# Altium schematic sheet revision_history.SchDoc
size A4; Date: 10/27/2015; Engineer: JBayalas; DocumentNumber: 2; Revision: V4.3.0; SheetNumber: 2; SheetTotal: 12
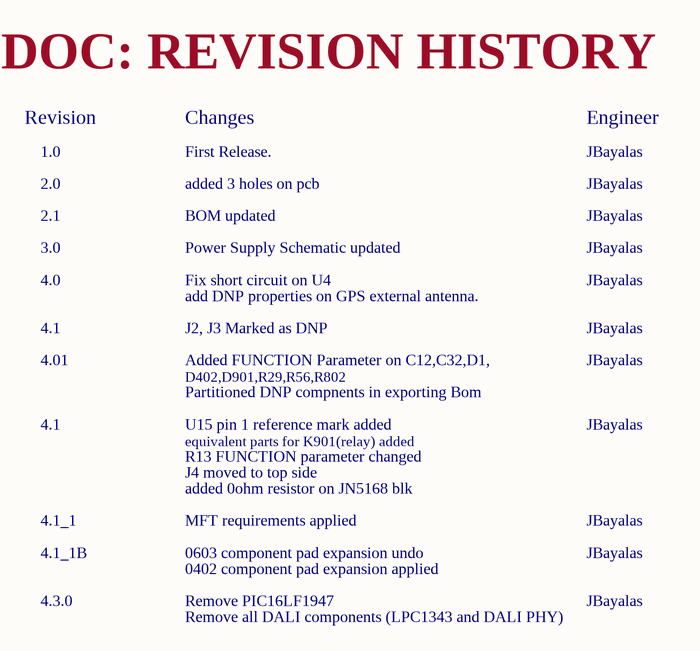
[diagram p0: revision_history.SchDoc]

## Notes on the sheet
- DOC: REVISION HISTORY
- Revision
- 1.0
- Changes
- First Release.
- Engineer
- JBayalas
- 2.0
- 2.1
- added 3 holes on pcb
- BOM updated
- 3.0
- 4.0
- Power Supply Schematic updated
- Fix short circuit on U4
- add DNP properties on GPS external antenna.
- 4.1
- 4.01
- J2, J3 Marked as DNP
- Added FUNCTION Parameter on C12,C32,D1,
- D402,D901,R29,R56,R802
- Partitioned DNP compnents in exporting Bom
- U15 pin 1 reference mark added
- equivalent parts for K901(relay) added
- R13 FUNCTION parameter changed
- J4 moved to top side
- 4.1_1
- 4.1_1B
- added 0ohm resistor on JN5168 blk
- MFT requirements applied
- 0603 component pad expansion undo
- 4.3.0
- 0402 component pad expansion applied
- Remove PIC16LF1947
- Remove all DALI components (LPC1343 and DALI PHY)
- Title:
- Sheet:
- Date:
- of
- Project:
- Revision:
- Engineer:
- Wi4B S.r.l